# EAGLE design Slave_V0.1 (EAGLE 9.6.2)

## Sheet 1 of 2
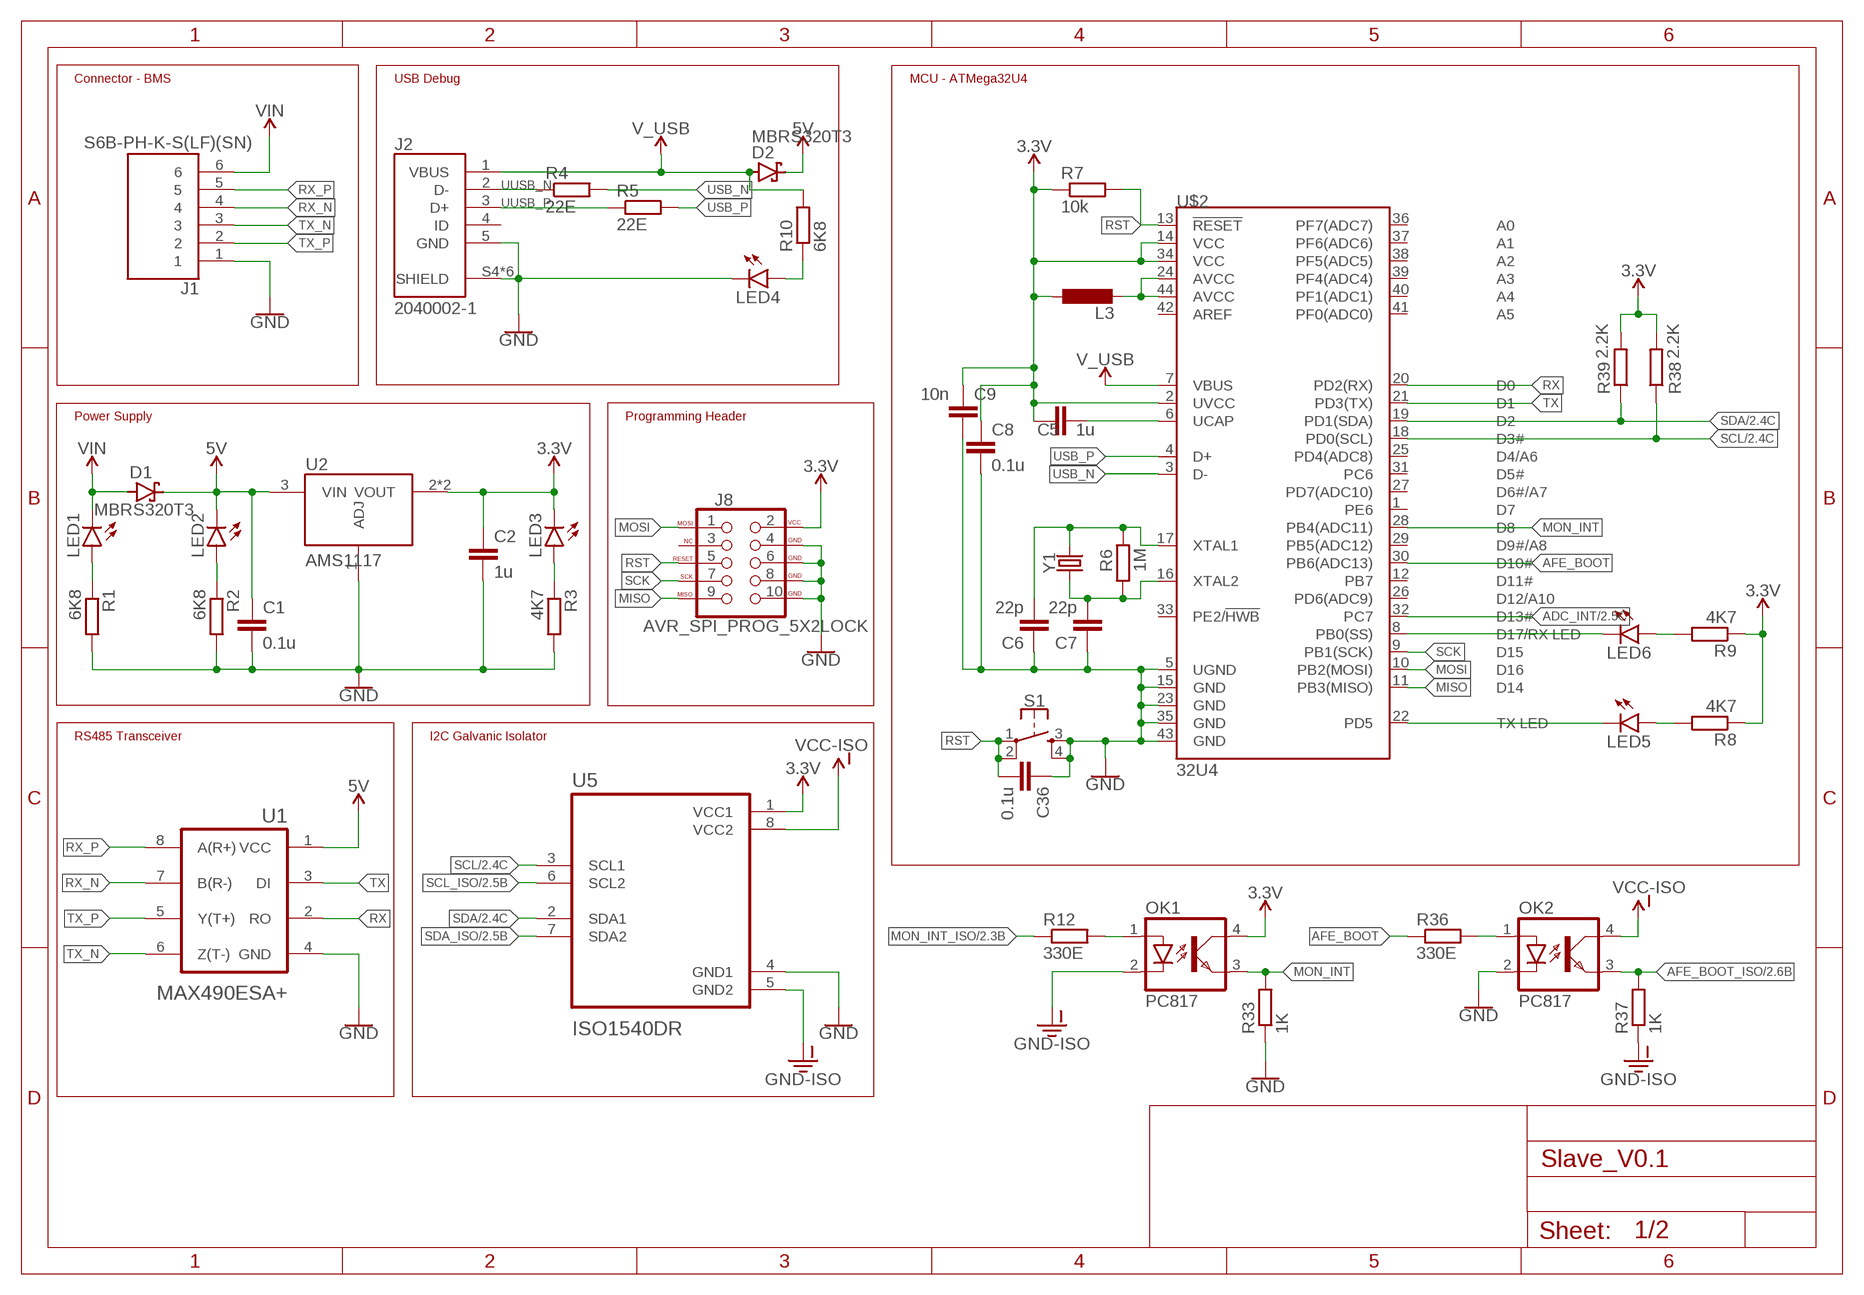
[diagram p0: schematic, sheet 1]

### Parts
C1  0.1u  C-EUC0805  [C0805]
C2  1u  C-EUC0805  [C0805]
C5  1u  C-EUC0805  [C0805]
C6  22p  C-EUC0805  [C0805]
C7  22p  C-EUC0805  [C0805]
C8  0.1u  C-EUC0805  [C0805]
C9  10n  C-EUC0805  [C0805]
C36  0.1u  C-EUC0805  [C0805]
D1  MBRS320T3  [SMC]
D2  MBRS320T3  [SMC]
J1  S6B-PH-K-S(LF)(SN)  [JST_S6B-PH-K-S(LF)(SN)]
J2  2040002-1  [TE_2040002-1]
J8  AVR_SPI_PROG_5X2LOCK  [2X5-SHROUDED_LOCK]
L3  L-EUL2012C  [L2012C]
LED1  LEDCHIPLED_0805  [CHIPLED_0805]
LED2  LEDCHIPLED_0805  [CHIPLED_0805]
LED3  LEDCHIPLED_0805  [CHIPLED_0805]
LED4  LEDCHIPLED_0805  [CHIPLED_0805]
LED5  LEDCHIPLED_0805  [CHIPLED_0805]
LED6  LEDCHIPLED_0805  [CHIPLED_0805]
OK1  PC817  [DIL04]
OK2  PC817  [DIL04]
R1  6K8  R-EU_R0805  [R0805]
R2  6K8  R-EU_R0805  [R0805]
R3  4K7  R-EU_R0805  [R0805]
R4  22E  R-EU_R0805  [R0805]
R5  22E  R-EU_R0805  [R0805]
R6  1M  R-EU_R0805  [R0805]
R7  10k  R-EU_R0805  [R0805]
R8  4K7  R-EU_R0805  [R0805]
R9  4K7  R-EU_R0805  [R0805]
R10  6K8  R-EU_R0805  [R0805]
R12  330E  R-EU_R0805  [R0805]
R33  1K  R-EU_R0805  [R0805]
R36  330E  R-EU_R0805  [R0805]
R37  1K  R-EU_R0805  [R0805]
R38  2.2K  R-EU_R0805  [R0805]
R39  2.2K  R-EU_R0805  [R0805]
S1  MOMENTARY-SWITCH-SPST-2-SMD-5.2MM  [TACTILE_SWITCH_SMD_5.2MM]
U1  MAX490ESA+  [SOIC127P600X175-8N]
U2  AMS1117  [SOT230P700X170-4]
U5  ISO1540DR  [SOIC127P599X175-8N]
U$2  32U4  ATMEGA32U4TQFP-44  [TQFP44]
Y1  CRYSTALPTH-HC49UV  [HC49U]

### Nets
3.3V: C2.1 C5.1 C8.1 C9.1 J8.2(VCC) L3.1 LED3.C OK1.4(COL) R7.1 R8.1 R9.1 R38.2 R39.2 U2.2(VOUT) U2.4(VOUT) U5.1(VCC1) U$2.2(UVCC) U$2.14(VCC) U$2.34(VCC) ; also sheet 2
5V: C1.1 D1.C D2.C LED2.C U1.1(VCC) U2.3(VIN)
ADC_INT: U$2.32(PC7) ; also sheet 2
AFE_BOOT: R36.1 U$2.30(PB6(ADC13))
AFE_BOOT_ISO: OK2.3(EMIT) R37.2 ; also sheet 2
GND: C1.2 C2.2 C6.1 C7.1 C8.2 C9.2 C36.1 J1.1 J2.5(GND) J2.S4(SHIELD) J2.S5(SHIELD) J2.SH1(SHIELD) J2.SH2(SHIELD) J2.SH3(SHIELD) J2.SH4(SHIELD) J8.4(GND) J8.6(GND) J8.8(GND) J8.10(GND) LED4.C OK2.2(C) R1.2 R2.2 R3.2 R33.1 S1.3 S1.4 U1.4(GND) U2.1(ADJ) U5.4(GND1) U$2.5(UGND) U$2.15(GND) U$2.23(GND) U$2.35(GND) U$2.43(GND) ; also sheet 2
GND-ISO: OK1.2(C) R37.1 U5.5(GND2) ; also sheet 2
MISO: J8.9(MISO) U$2.11(PB3(MISO))
MON_INT: OK1.3(EMIT) R33.2 U$2.28(PB4(ADC11))
MON_INT_ISO: R12.1 ; also sheet 2
MOSI: J8.1(MOSI) U$2.10(PB2(MOSI))
N$1: LED1.A R1.1
N$2: LED3.A R3.1
N$3: LED2.A R2.1
N$7: L3.2 U$2.24(AVCC) U$2.44(AVCC)
N$8: C5.2 U$2.6(UCAP)
N$9: C6.2 R6.2 U$2.17(XTAL1) Y1.2
N$10: LED5.C U$2.22(PD5)
N$11: C7.2 R6.1 U$2.16(XTAL2) Y1.1
N$12: LED5.A R8.2
N$13: LED6.C U$2.8(PB0(SS))
N$14: LED6.A R9.2
N$15: LED4.A R10.1
N$43: OK2.1(A) R36.2
N$45: OK1.1(A) R12.2
RST: C36.2 J8.5(RESET) R7.2 S1.1 S1.2 U$2.13(!RESET)
RX: U1.2(RO) U$2.20(PD2(RX))
RX_N: J1.4 U1.7(B(R-))
RX_P: J1.5 U1.8(A(R+))
SCK: J8.7(SCK) U$2.9(PB1(SCK))
SCL: R38.1 U5.3(SCL1) U$2.18(PD0(SCL)) ; also sheet 2
SCL_ISO: U5.6(SCL2) ; also sheet 2
SDA: R39.1 U5.2(SDA1) U$2.19(PD1(SDA)) ; also sheet 2
SDA_ISO: U5.7(SDA2) ; also sheet 2
TX: U1.3(DI) U$2.21(PD3(TX))
TX_N: J1.3 U1.6(Z(T-))
TX_P: J1.2 U1.5(Y(T+))
USB_N: R4.2 U$2.3(D-)
USB_P: R5.2 U$2.4(D+)
UUSB_N: J2.2(D-) R4.1
UUSB_P: J2.3(D+) R5.1
V_USB: D2.A J2.1(VBUS) R10.2 U$2.7(VBUS)
VCC-ISO: OK2.4(COL) U5.8(VCC2) ; also sheet 2
VIN: D1.A J1.6 LED1.C
Unconnected: J2.4(ID) J8.3(NC) U$2.1(PE6) U$2.12(PB7) U$2.25(PD4(ADC8)) U$2.26(PD6(ADC9)) U$2.27(PD7(ADC10)) U$2.29(PB5(ADC12)) U$2.31(PC6) U$2.33(PE2/!HWB) U$2.36(PF7(ADC7)) U$2.37(PF6(ADC6)) U$2.38(PF5(ADC5)) U$2.39(PF4(ADC4)) U$2.40(PF1(ADC1)) U$2.41(PF0(ADC0)) U$2.42(AREF)

### Notes on the sheet
- Connector - BMS | USB Debug | MCU - ATMega32U4
- Power Supply | Programming Header
- RS485 Transceiver | I2C Galvanic Isolator

## Sheet 2 of 2
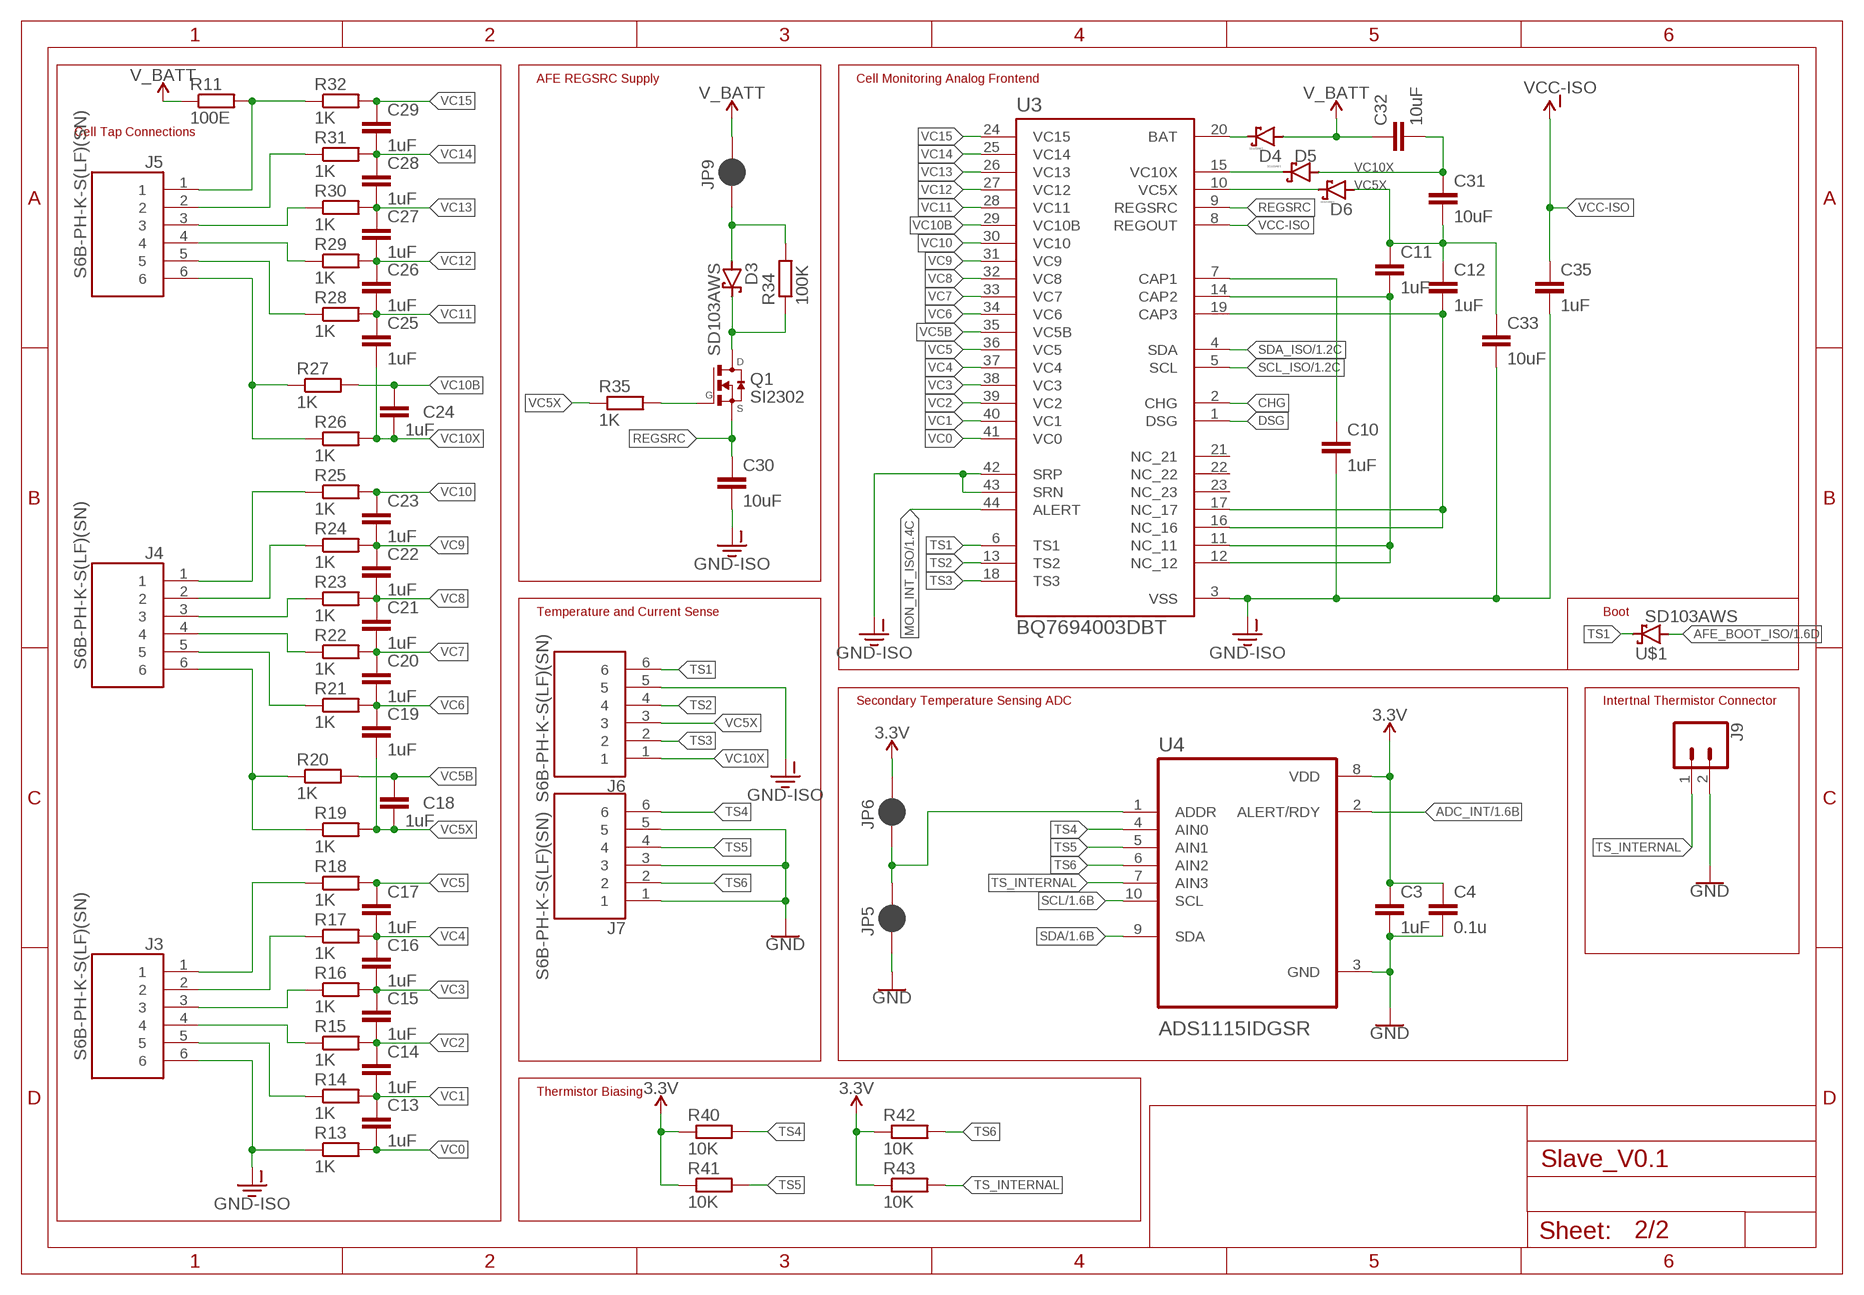
[diagram p1: schematic, sheet 2]

### Parts
C3  1uF  C-EUC0805K  [C0805K]
C4  0.1u  C-EUC0805K  [C0805K]
C10  1uF  C-EUC0805  [C0805]
C11  1uF  C-EUC0805  [C0805]
C12  1uF  C-EUC0805  [C0805]
C13  1uF  C-EUC0805  [C0805]
C14  1uF  C-EUC0805  [C0805]
C15  1uF  C-EUC0805  [C0805]
C16  1uF  C-EUC0805  [C0805]
C17  1uF  C-EUC0805  [C0805]
C18  1uF  C-EUC0805  [C0805]
C19  1uF  C-EUC0805  [C0805]
C20  1uF  C-EUC0805  [C0805]
C21  1uF  C-EUC0805  [C0805]
C22  1uF  C-EUC0805  [C0805]
C23  1uF  C-EUC0805  [C0805]
C24  1uF  C-EUC0805  [C0805]
C25  1uF  C-EUC0805  [C0805]
C26  1uF  C-EUC0805  [C0805]
C27  1uF  C-EUC0805  [C0805]
C28  1uF  C-EUC0805  [C0805]
C29  1uF  C-EUC0805  [C0805]
C30  10uF  C-EUC0805  [C0805]
C31  10uF  C-EUC0805  [C0805]
C32  10uF  C-EUC0805  [C0805]
C33  10uF  C-EUC0805  [C0805]
C35  1uF  C-EUC0805  [C0805]
D3  SD103AWS  [SOD323_ST]
D4  SD103AWS  [SOD323_ST]
D5  SD103AWS  [SOD323_ST]
D6  SD103AWS  [SOD323_ST]
J3  S6B-PH-K-S(LF)(SN)  [JST_S6B-PH-K-S(LF)(SN)]
J4  S6B-PH-K-S(LF)(SN)  [JST_S6B-PH-K-S(LF)(SN)]
J5  S6B-PH-K-S(LF)(SN)  [JST_S6B-PH-K-S(LF)(SN)]
J6  S6B-PH-K-S(LF)(SN)  [JST_S6B-PH-K-S(LF)(SN)]
J7  S6B-PH-K-S(LF)(SN)  [JST_S6B-PH-K-S(LF)(SN)]
J9  CONN_023.5MM-NO_SILK  [SCREWTERMINAL-3.5MM-2-NS]
JP5  JUMPER-SMT_2_NC_PASTE_SILK  [SMT-JUMPER_2_NC_PASTE_SILK]
JP6  JUMPER-SMT_2_NC_PASTE_SILK  [SMT-JUMPER_2_NC_PASTE_SILK]
JP9  JUMPER-SMT_2_NC_PASTE_SILK  [SMT-JUMPER_2_NC_PASTE_SILK]
Q1  SI2302  [SOT23]
R11  100E  R-EU_R0805  [R0805]
R13  1K  R-EU_R0805  [R0805]
R14  1K  R-EU_R0805  [R0805]
R15  1K  R-EU_R0805  [R0805]
R16  1K  R-EU_R0805  [R0805]
R17  1K  R-EU_R0805  [R0805]
R18  1K  R-EU_R0805  [R0805]
R19  1K  R-EU_R0805  [R0805]
R20  1K  R-EU_R0805  [R0805]
R21  1K  R-EU_R0805  [R0805]
R22  1K  R-EU_R0805  [R0805]
R23  1K  R-EU_R0805  [R0805]
R24  1K  R-EU_R0805  [R0805]
R25  1K  R-EU_R0805  [R0805]
R26  1K  R-EU_R0805  [R0805]
R27  1K  R-EU_R0805  [R0805]
R28  1K  R-EU_R0805  [R0805]
R29  1K  R-EU_R0805  [R0805]
R30  1K  R-EU_R0805  [R0805]
R31  1K  R-EU_R0805  [R0805]
R32  1K  R-EU_R0805  [R0805]
R34  100K  R-EU_R0805  [R0805]
R35  1K  R-EU_R0805  [R0805]
R40  10K  R-EU_R0805  [R0805]
R41  10K  R-EU_R0805  [R0805]
R42  10K  R-EU_R0805  [R0805]
R43  10K  R-EU_R0805  [R0805]
U3  BQ7694003DBT  [SOP50P640X120-44N]
U4  ADS1115IDGSR  [SOP50P490X110-10N]
U$1  SD103AWS  [SOD323_ST]

### Nets
3.3V: C3.1 C4.1 JP6.2 R40.1 R41.1 R42.1 R43.1 U4.8(VDD) ; also sheet 1
ADC_INT: U4.2(ALERT/RDY) ; also sheet 1
AFE_BOOT_ISO: U$1.A ; also sheet 1
CHG: U3.2(CHG)
DSG: U3.1(DSG)
GND: C3.2 C4.2 J7.1 J7.3 J7.5 J9.2 JP5.1 U4.3(GND) ; also sheet 1
GND-ISO: C10.2 C30.2 C33.2 C35.2 J3.6 J6.5 R13.1 U3.3(VSS) U3.42(SRP) U3.43(SRN) ; also sheet 1
MON_INT_ISO: U3.44(ALERT) ; also sheet 1
N$16: JP5.2 JP6.1 U4.1(ADDR)
N$17: C10.1 U3.7(CAP1)
N$18: C11.2 U3.11(NC_11) U3.12(NC_12) U3.14(CAP2)
N$19: D3.A JP9.1 R34.2
N$20: D3.C Q1.3(D) R34.1
N$21: C12.2 U3.16(NC_16) U3.17(NC_17) U3.19(CAP3)
N$22: J4.4 R22.1
N$23: J4.3 R23.1
N$24: J4.2 R24.1
N$25: J4.5 R21.1
N$26: J4.6 R19.1 R20.1
N$27: J4.1 R25.1
N$28: J3.4 R15.1
N$29: J3.3 R16.1
N$30: J3.2 R17.1
N$31: J3.5 R14.1
N$32: J5.4 R29.1
N$33: J3.1 R18.1
N$34: J5.3 R30.1
N$35: J5.2 R31.1
N$36: J5.5 R28.1
N$37: J5.6 R26.1 R27.1
N$38: Q1.1(G) R35.2
N$39: J5.1 R11.2 R32.1
N$40: D4.C U3.20(BAT)
N$41: D5.C U3.15(VC10X)
N$42: D6.C U3.10(VC5X)
REGSRC: C30.1 Q1.2(S) U3.9(REGSRC)
SCL: U4.10(SCL) ; also sheet 1
SCL_ISO: U3.5(SCL) ; also sheet 1
SDA: U4.9(SDA) ; also sheet 1
SDA_ISO: U3.4(SDA) ; also sheet 1
TS1: J6.6 U3.6(TS1) U$1.C
TS2: J6.4 U3.13(TS2)
TS3: J6.2 U3.18(TS3)
TS4: J7.6 R40.2 U4.4(AIN0)
TS5: J7.4 R41.2 U4.5(AIN1)
TS6: J7.2 R42.2 U4.6(AIN2)
TS_INTERNAL: J9.1 R43.2 U4.7(AIN3)
V_BATT: C32.1 D4.A JP9.2 R11.1
VC0: C13.2 R13.2 U3.41(VC0)
VC1: C13.1 C14.2 R14.2 U3.40(VC1)
VC2: C14.1 C15.2 R15.2 U3.39(VC2)
VC3: C15.1 C16.2 R16.2 U3.38(VC3)
VC4: C16.1 C17.2 R17.2 U3.37(VC4)
VC5: C17.1 R18.2 U3.36(VC5)
VC5B: C18.1 R20.2 U3.35(VC5B)
VC5X: C11.1 C12.1 C18.2 C19.2 C31.2 C33.1 D6.A J6.3 R19.2 R35.1
VC6: C19.1 C20.2 R21.2 U3.34(VC6)
VC7: C20.1 C21.2 R22.2 U3.33(VC7)
VC8: C21.1 C22.2 R23.2 U3.32(VC8)
VC9: C22.1 C23.2 R24.2 U3.31(VC9)
VC10: C23.1 R25.2 U3.30(VC10)
VC10B: C24.1 R27.2 U3.29(VC10B)
VC10X: C24.2 C25.2 C31.1 C32.2 D5.A J6.1 R26.2
VC11: C25.1 C26.2 R28.2 U3.28(VC11)
VC12: C26.1 C27.2 R29.2 U3.27(VC12)
VC13: C27.1 C28.2 R30.2 U3.26(VC13)
VC14: C28.1 C29.2 R31.2 U3.25(VC14)
VC15: C29.1 R32.2 U3.24(VC15)
VCC-ISO: C35.1 U3.8(REGOUT) ; also sheet 1
Unconnected: U3.21(NC_21) U3.22(NC_22) U3.23(NC_23)

### Notes on the sheet
- AFE REGSRC Supply | Cell Monitoring Analog Frontend
- Cell Tap Connections
- Temperature and Current Sense | Boot
- Secondary Temperature Sensing ADC | Intertnal Thermistor Connector
- Thermistor Biasing

## Library data of the parts
C1-C33 C35 C36 = rcl:C-EU: CAPACITOR, European symbol; SPICEPREFIX: C
D1 D2 = diode:MBRS3*0T3: SCHOTTKY BARRIER RECTIFIER 3.0 AMPERES 20, 30, 40 VOLT Source: MBRS340T3-D.pdf
D3-D6 U$1 = diode:SD103AWS
J1 = S6B-PH-K-S_LF__SN_:S6B-PH-K-S(LF)(SN): PH Series 6 Position 2 mm Pitch Through Hole Side Entry Shrouded Header; AVAILABILITY: Unavailable; DESCRIPTION: Connector Header Through Hole, Right Angle 6 position 0.079 (2.00mm); MF: JST Sales; MP: S6B-PH-K-S(LF)(SN); PACKAGE: None; PRICE: None; PURCHASELINK: https://www.sunrom.com/p/6-pin-jst-ph-20mm-through-hole-header-horizontal-right-angle-side-entry
J2 = 2040002-1:2040002-1: Conn USB Type B RCP 5 POS 0.65mm Solder RA SMD 5 Terminal 1 Port T/R; AVAILABILITY: Unavailable; CENTERLINE_PITCH: .65 mm[.025 in]; COMMENT: 2040002-1; DESCRIPTION: Conn Micro USB 2.0 Type B RCP 5 POS 0.65mm Solder RA SMD 5 Terminal 1 Port T/R; MF: TE Connectivity; MP: 2040002-1; NUMBER_OF_POSITIONS: 5; PACKAGE: None; PRICE: None; PRODUCT_TYPE: Connector; TE_PURCHASE_URL: https://www.te.com/usa-en/product-2040002-1.html?te_bu=Cor&te_type=disp&te_campaign=seda_glo_cor-seda-global-disp-prtnr-fy19-seda-model-bom-cta_sma-317_1&elqCampaignId=32493
J3-J7 = S6B-PH-K-S_LF__SN_:S6B-PH-K-S(LF)(SN): PH Series 6 Position 2 mm Pitch Through Hole Side Entry Shrouded Header; AVAILABILITY: Unavailable; DESCRIPTION: Connector Header Through Hole, Right Angle 6 position 0.079 (2.00mm); MF: JST Sales; MP: S6B-PH-K-S(LF)(SN); PACKAGE: None; PRICE: None
J8 = SparkFun-Connectors:AVR_SPI_PROG_5X2: AVR 10-pin ICSP Header This is the standard AVR In Circuit Serial Programming header. Minimal, but includes pin one indicator. Works with standard Olimex programmers. SparkFun Products: 2x5 AVR ICSP Male Header <https://www.sparkfun.com/products/778> - PTH 2x5 Pin Shrouded Header <https://www.sparkfun.com/products/8506> - PTH2; PROD_ID: CONN-08671; SF_ID: PRT-08506
J9 = SparkFun-Connectors:CONN_02: Multi connection point. Often used as Generic Header-pin footprint for 0.1 inch spaced/style header connections On any of the 0.1 inch spaced packages, you can populate with these: Break Away Headers - Straight <https://www.sparkfun.com/products/116> (PRT-00116) Break Away Male Headers - Right Angle <https://www.sparkfun.com/products/553> (PRT-00553) Female Headers <https://www.sparkfun.com/products/115> (PRT-00115) Break Away Headers - Machine Pin <https://www.sparkfun.com/products/117> (PRT-00117) Break Away Female Headers - Swiss Machine Pin <https://www.sparkfun.com/products/743> (PRT-00743) For SCREWTERMINALS and SPRING TERMINALS visit here: Screw Terimnals on SparkFun.com <https://www.sparkfun.com/search/results?term=Screw+Terminals> (5mm/3.5mm/2.54mm spacing) This device is also useful as a general connection point to wire up your design to another part of your project. Our various solder wires solder well into these plated through hole pads. Hook-Up Wire - Assortment (Stranded, 22 AWG) <https://www.sparkfun.com/products/11375> (PRT-11375) Hook-Up Wire - Assortment (Solid Core, 22 AWG) <https://www.sparkfun.com/products/11367> (PRT-11367) View the entire wire category on our website here <https://www.sparkfun.com/categories/141> Special notes: Molex polarized connector foot print use with: PRT-08233 with associated crimp pins and housings. 2.54_SCREWTERM for use with PRT-10571. 3.5mm Screw Terminal footprints for PRT-08084 5mm Screw Terminal footprints for use with PRT-08432; PROD_ID: CONN-08399
JP5 JP6 JP9 = SparkFun-Jumpers:JUMPER-SMT_2_NC_PASTE: Normally closed solder jumper This jumper has an aperture in the stencil to allow solder paste to bridge the split in the wire so it's normally closed (NC). Wick off the solder to open the connection. Reapply solder to reclose the connection.
L3 = rcl:L-EU: INDUCTOR, European symbol; SPICEPREFIX: L
LED1-LED6 = led:LED: LED OSRAM: - CHIPLED LG R971, LG N971, LY N971, LG Q971, LY Q971, LO R971, LY R971 LH N974, LH R974 LS Q976, LO Q976, LY Q976 LO Q996 - Hyper CHIPLED LW Q18S LB Q993, LB Q99A, LB R99A - SideLED LS A670, LO A670, LY A670, LG A670, LP A670 LB A673, LV A673, LT A673, LW A673 LH A674 LY A675 LS A676, LA A676, LO A676, LY A676, LW A676 LS A679, LY A679, LG A679 - Hyper Micro SIDELED® LS Y876, LA Y876, LO Y876, LY Y876 LT Y87S - SmartLED LW L88C, LW L88S LB L89C, LB L89S, LG L890 LS L89K, LO L89K, LY L89K LS L896, LA L896, LO L896, LY L896 - TOPLED LS T670, LO T670, LY T670, LG T670, LP T670 LSG T670, LSP T670, LSY T670, LOP T670, LYG T670 LG T671, LOG T671, LSG T671 LB T673, LV T673, LT T673, LW T673 LH T674 LS T676, LA T676, LO T676, LY T676, LB T676, LH T676, LSB T676, LW T676 LB T67C, LV T67C, LT T67C, LS T67K, LO T67K, LY T67K, LW E67C LS E67B, LA E67B, LO E67B, LY E67B, LB E67C, LV E67C, LT E67C LW T67C LS T679, LY T679, LG T679 LS T770, LO T770, LY T770, LG T770, LP T770 LB T773, LV T773, LT T773, LW T773 LH T774 LS E675, LA E675, LY E675, LS T675 LS T776, LA T776, LO T776, LY T776, LB T776 LHGB T686 LT T68C, LB T68C - Hyper Mini TOPLED® LB M676 - Mini TOPLED Santana® LG M470 LS M47K, LO M47K, LY M47K Source: http://www.osram.convergy.de LUXEON: - LUMILED® LXK2-PW12-R00, LXK2-PW12-S00, LXK2-PW14-U00, LXK2-PW14-V00 LXK2-PM12-R00, LXK2-PM12-S00, LXK2-PM14-U00 LXK2-PE12-Q00, LXK2-PE12-R00, LXK2-PE12-S00, LXK2-PE14-T00, LXK2-PE14-U00 LXK2-PB12-K00, LXK2-PB12-L00, LXK2-PB12-M00, LXK2-PB14-N00, LXK2-PB14-P00, LXK2-PB14-Q00 LXK2-PR12-L00, LXK2-PR12-M00, LXK2-PR14-Q00, LXK2-PR14-R00 LXK2-PD12-Q00, LXK2-PD12-R00, LXK2-PD12-S00 LXK2-PH12-R00, LXK2-PH12-S00 LXK2-PL12-P00, LXK2-PL12-Q00, LXK2-PL12-R00 Source: www.luxeon.com KINGBRIGHT: KA-3528ASYC Source: www.kingbright.com
OK1 OK2 = optocoupler:PC817: SHARP OPTO COUPLER; MPN: PC817X4J000F; OC_FARNELL: 9707727; OC_NEWARK: 97K7059
Q1 = SI2302:SI2302: MOSFET N-Channel 20 V (D-S); AVAILABILITY: Unavailable; DESCRIPTION: N-Channel 20V 2.6A _Ta_ 710mW _Ta_ Surface Mount SOT-23-3 _TO-236_; MF: Vishay Siliconix; MP: SI2302; PACKAGE: SOT-23-3 Vishay Siliconix; PRICE: None
R1-R43 = rcl:R-EU_: RESISTOR, European symbol; SPICEPREFIX: R
S1 = SparkFun-Switches:MOMENTARY-SWITCH-SPST-2: Momentary Switch (Pushbutton) - SPST - Two Circuits Normally-open (NO) SPST momentary switches (buttons, pushbuttons). Schematic symbol includes two switch circuits. Variants SMD-4.6MMX2.8MM - 4.60mm x 2.80mm Tactile Momentary Button Switch - Used on SparkFun SAMD21 Mini Breakout <https://www.sparkfun.com/products/13664> SMD-5.2MM - Mini Pushbutton Switch - SMD <https://www.sparkfun.com/products/8720> - Used on Arduino Pro Mini <https://www.sparkfun.com/products/11114>; PROD_ID: SWCH-08247; SF_SKU: COM-08720
U1 = MAX490ESA_:MAX490ESA+: None Check prices <https://snapeda.com/parts/MAX490ESA%2B/Maxim%20Integrated/view-part/?ref=eda>; AVAILABILITY: Warning; DESCRIPTION: 1/1 Transceiver Full RS422, RS485 8-SOIC; DIGIKEY-PURCHASE-URL: https://snapeda.com/shop?store=DigiKey&id=1237744; MF: Maxim Integrated; MOUSER-PURCHASE-URL: https://snapeda.com/shop?store=Mouser&id=1237744; MP: MAX490ESA+; PACKAGE: SOIC-8 Maxim; PRICE: None
U2 = AMS1117:AMS1117: Sot223/Pkg 1-Amp 5-Volt Low Drop Out Voltage Regulatator; DATASHEET-URL: http://www.advanced-monolithic.com/pdf/ds1117.pdf; DESCRIPTION: 3.3V 1A LDO; MF: Advanced Monolithic Systems, Inc.; MP: AMS1117; PACKAGE: SOT-223; PURCHASE-URL: https://www.evelta.com/ams1117-3-3-advanced-monolithic-systems-3-3v-1a-ldo-voltage-regulator/
U3 = BQ7694003DBT:BQ7694003DBT: 9 to 15-series cell li-ion and li-phosphate battery monitor (bq76940 family) 44-TSSOP -40 to 85 Check prices <https://snapeda.com/parts/BQ7694003DBT/Texas%20Instruments/view-part/?ref=eda>; AVAILABILITY: Good; DESCRIPTION: 9 to 15-series cell li-ion and li-phosphate battery monitor (bq76940 family) 44-TSSOP -40 to 85; DIGIKEY-PURCHASE-URL: https://snapeda.com/shop?store=DigiKey&id=425582; MF: Texas Instruments; MOUSER-PURCHASE-URL: https://snapeda.com/shop?store=Mouser&id=425582; MP: BQ7694003DBT; PACKAGE: TSSOP-44 Texas Instruments; PRICE: None; TEXAS_INSTRUMENTS-PURCHASE-URL: https://snapeda.com/shop?store=Texas+Instruments&id=425582
U4 = ADS1115IDGSR:ADS1115IDGSR: Check prices <https://snapeda.com/parts/ADS1115IDGSR/Texas%20Instruments/view-part/?ref=eda>; AVAILABILITY: Good; DESCRIPTION: 16-Bit 860SPS 4-Ch Delta-Sigma ADC With PGA, Oscillator, Vref, Comparator, and I2C 10-VSSOP -40 to 125; DIGIKEY-PURCHASE-URL: https://snapeda.com/shop?store=DigiKey&id=45903; MF: Texas Instruments; MOUSER-PURCHASE-URL: https://snapeda.com/shop?store=Mouser&id=45903; MP: ADS1115IDGSR; PACKAGE: VSSOP-10 Texas Instruments; PRICE: None; TEXAS_INSTRUMENTS-PURCHASE-URL: https://snapeda.com/shop?store=Texas+Instruments&id=45903
U5 = ISO1540DR:ISO1540DR: Check prices <https://pricing.snapeda.com/search/part/ISO1540DR/?ref=eda>; AVAILABILITY: Good; DESCRIPTION: 2.5-kVrms, isolated bidirectional clock, bidirectional I2C isolator 8-SOIC -40 to 125; MF: Texas Instruments; MP: ISO1540DR; PACKAGE: SOIC-8 Texas Instruments; PRICE: None; PURCHASE-URL: https://pricing.snapeda.com/search/part/ISO1540DR/?ref=eda
U$2 = SparkFun-IC-Microcontroller:ATMEGA32U4: Atmel MCU, 32KByte Atmel 44-pin 8-bit Microcontroller with 32KBytes of ISP Flash and USB Controller Datasheet <http://cdn.sparkfun.com/datasheets/Dev/Arduino/Boards/ATMega32U4.pdf> SparkFun Products LilyPad Arduino USB - ATmega32U4 Board <https://www.sparkfun.com/products/12049> (DEV-12049) Pro Micro - 5V/16MHz <https://www.sparkfun.com/products/12640> (DEV-12640) Pro Micro - 3.3V/8MHz <https://www.sparkfun.com/products/12587> (DEV-12587) Fio v3 - ATmega32U4 <https://www.sparkfun.com/products/11520> (DEV-11520) Qduino Mini <https://www.sparkfun.com/products/13614> (DEV-13614) Makey Makey - Standard Kit <https://www.sparkfun.com/products/11511> (WIG-11511) Makey Makey Deluxe Kit <https://www.sparkfun.com/products/11519> (WIG-11519); PROD_ID: IC-11161
Y1 = SparkFun-Clocks:CRYSTAL: Crystals (Generic) These are passive quartz crystals, which can be used as a clock source for a microcontroller. Crystal's are two-terminal devices. They require external "load" capacitors to generate an oscillating signal.

## Board
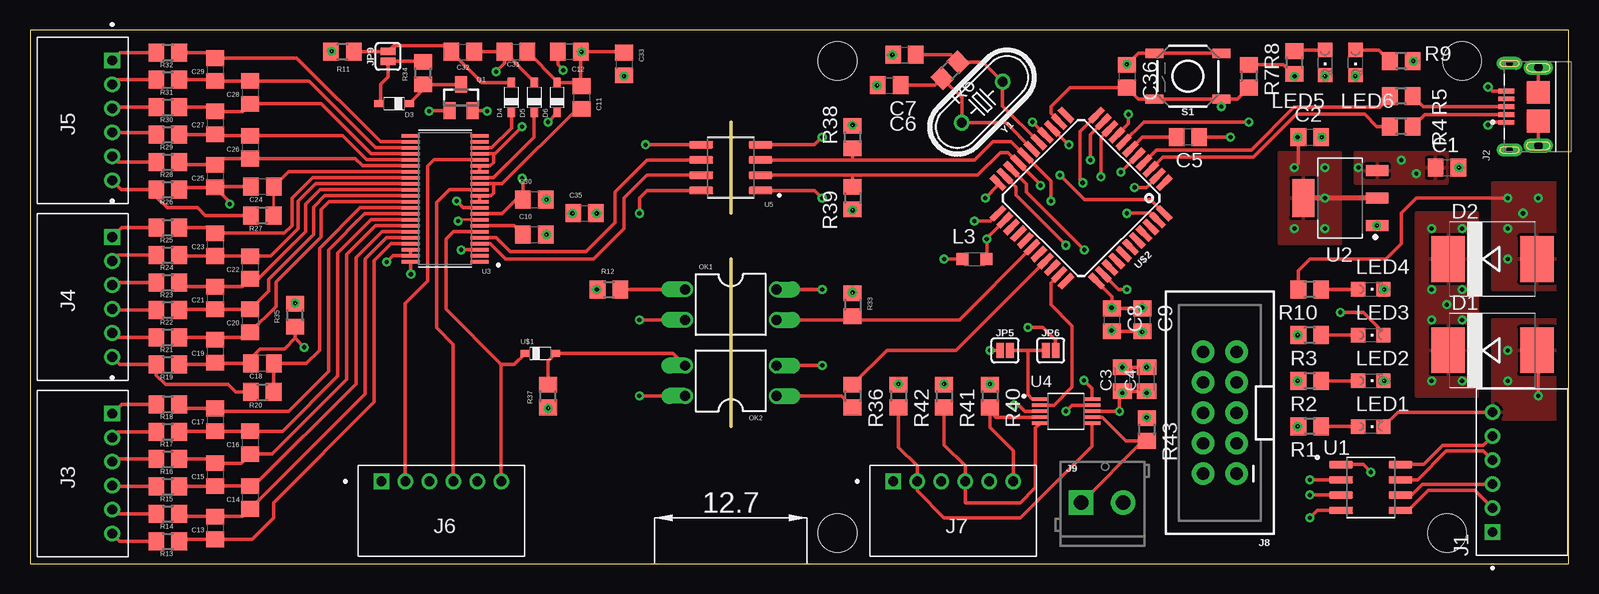
[diagram p2: board, top side]
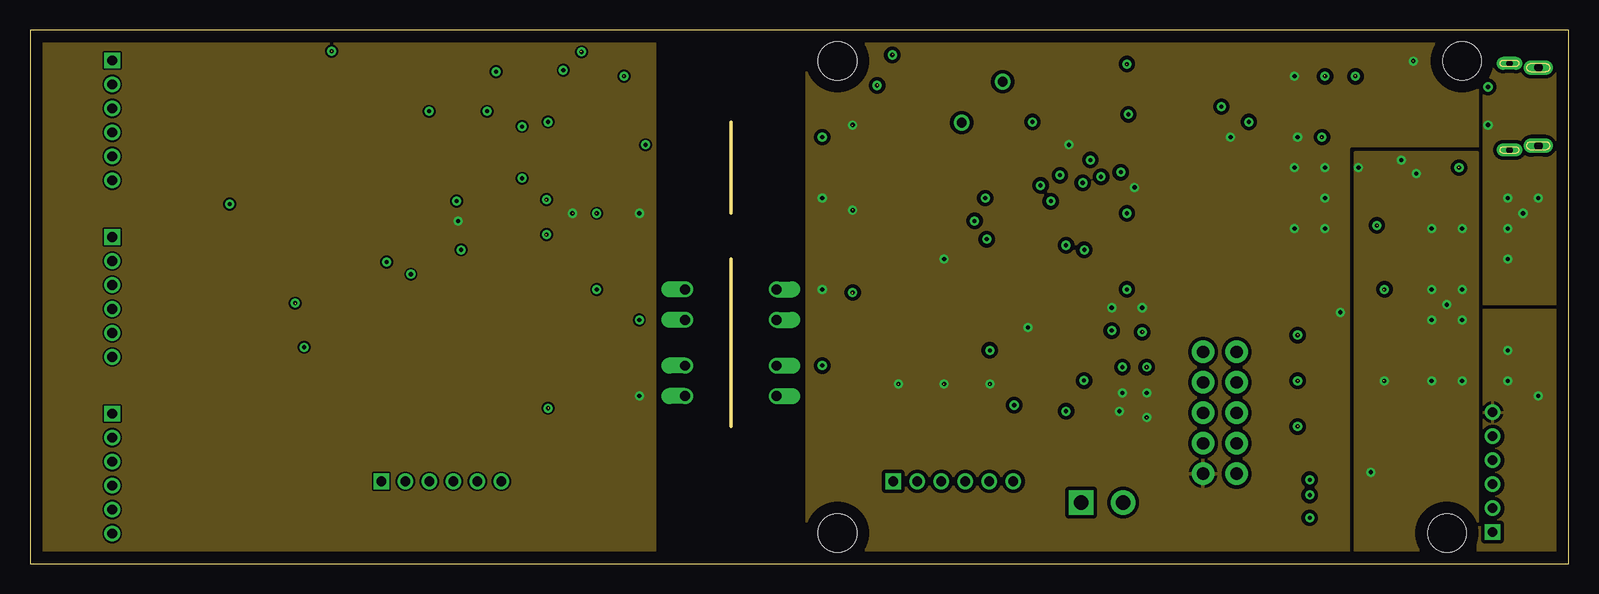
[diagram p3: board, inner layer PWR]
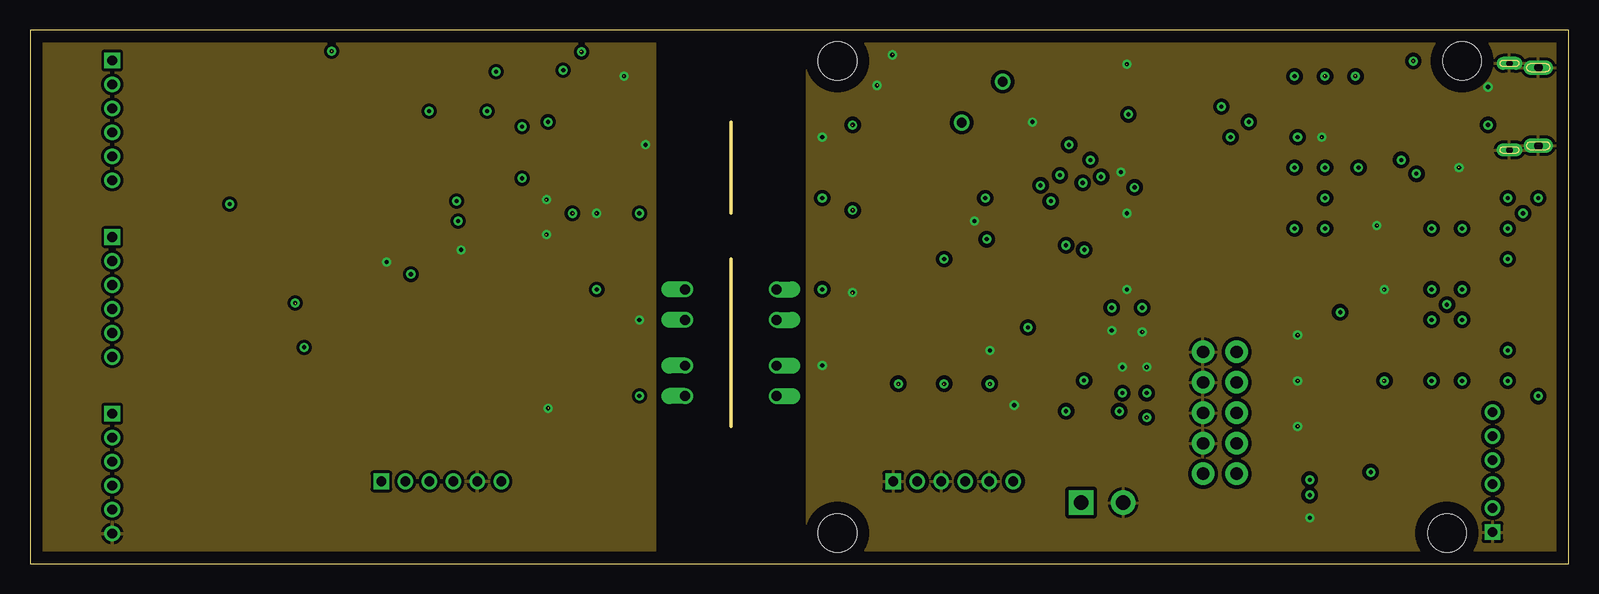
[diagram p4: board, inner layer GND]
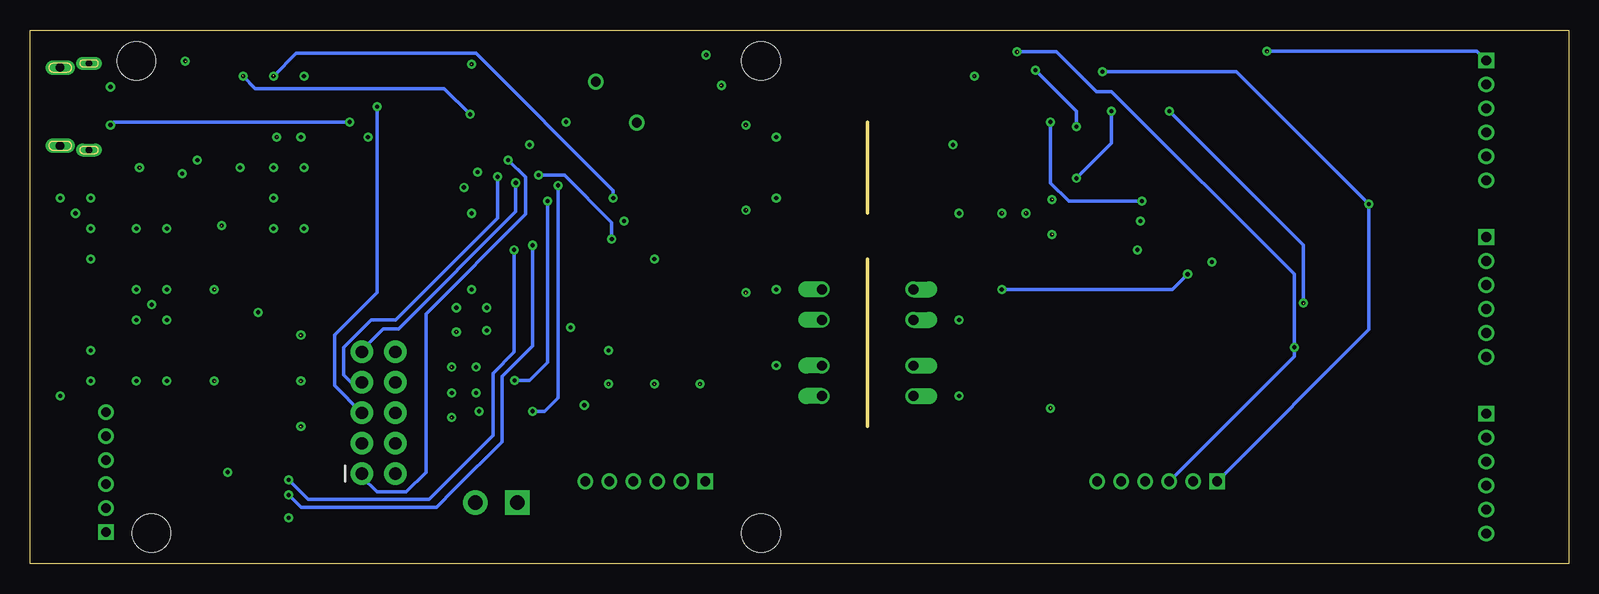
[diagram p5: board, bottom side, seen from below]

Size 128.25 x 44.5 mm. Coordinates in mm from the lower left corner, seen from the top.
Outline: 0,0 128.25,0 128.25,44.5 0,44.5 0,0
Copper layers (1+2*15+16): Top 0.035mm / dielectric 1.5mm / PWR 0.035mm / dielectric 0.15mm / GND 0.035mm / dielectric 0.2mm / Bottom 0.035mm
Design rules "default *": minimum track width 8mil, minimum drill 0.35mm, track to track 6mil, track to pad 6mil, pad to pad 6mil, via to via 6mil, smd to smd 6mil, copper to edge 40mil, drill to drill 6mil, minimum pad ring 10mil, minimum via ring 8mil, stop-mask expansion 4mil, vias tented up to drill 15mil, thermal gap 10mil
Holes 3.2 mm at 67.31,41.91 67.31,2.54 119.38,41.91 118.11,2.54
Milling: 2 lines

### Footprints (pad centres in the part's own frame; a part is rotated, then mirrored left to right if it is on the bottom)
C0805 = smd 1.3 x 1.5: 1 -0.95,0; 2 0.95,0
C0805K = smd 1.3 x 1.6: 1 -1,0; 2 1,0
SMC = smd 2.8 x 3.8: A 3.7,0; C -3.7,0
SOD323_ST = smd 0.8 x 0.6: A 1.25,0; C -1.25,0
JST_S6B-PH-K-S(LF)(SN) = drill 0.8 pad 1.2 square: 1 -5,0 | drill 0.8 pad 1.2: 2 -3,0; 3 -1,0; 4 1,0; 5 3,0; 6 5,0
TE_2040002-1 = smd 0.4 x 1.35: 1 -1.3,2.675; 2 -0.65,2.675; 3 0,2.675; 4 0.65,2.675; 5 1.3,2.675 | smd 1.9 x 1.9: S4 -1.2,0; S5 1.2,0 | drill 0.56 long: SH1 -3.615,2.4; SH2 3.615,2.4 | drill 0.71 long: SH3 3.255,0; SH4 -3.255,0
2X5-SHROUDED_LOCK = drill 1.016 pad 1.88: 1 -1.397,5.08; 2 1.397,5.08; 3 -1.397,2.54; 4 1.397,2.54; 5 -1.397,0; 6 1.397,0; 7 -1.397,-2.54; 8 1.397,-2.54; 9 -1.397,-5.08; 10 1.397,-5.08
SCREWTERMINAL-3.5MM-2-NS = drill 1.2 pad 2.032 square: 1 0,0 | drill 1.2 pad 2.032: 2 3.5,0
SMT-JUMPER_2_NC_PASTE_SILK = smd 0.635 x 1.27: 1 -0.406,0; 2 0.406,0
L2012C = smd 1 x 1: 1 -1,0; 2 1,0
CHIPLED_0805 = smd 1.2 x 1.2: A 0,-1.05; C 0,1.05
DIL04 = drill 0.813 offset: 1 -1.27,-3.81; 2 1.27,-3.81; 3 1.27,3.81; 4 -1.27,3.81
SOT23 = smd 1 x 1.4: 1 -0.95,-1.1; 2 0.95,-1.1; 3 0,1.1
R0805 = smd 1.3 x 1.5: 1 -0.95,0; 2 0.95,0
TACTILE_SWITCH_SMD_5.2MM = smd 1.524 x 0.762: 1 -2.794,1.905; 2 2.794,1.905; 3 -2.794,-1.905; 4 2.794,-1.905
SOIC127P600X175-8N = smd 1.97 x 0.59: 1 -2.475,1.905; 2 -2.475,0.635; 3 -2.475,-0.635; 4 -2.475,-1.905; 5 2.475,-1.905; 6 2.475,-0.635; 7 2.475,0.635; 8 2.475,1.905
SOT230P700X170-4 = smd 1.86 x 0.898: 1 -3.075,2.3; 2 -3.075,0; 3 -3.075,-2.3 | smd 1.86 x 3.189: 4 3.075,0
SOP50P640X120-44N = smd 1.57 x 0.28: 1 -2.87,5.25; 2 -2.87,4.75; 3 -2.87,4.25; 4 -2.87,3.75; 5 -2.87,3.25; 6 -2.87,2.75; 7 -2.87,2.25; 8 -2.87,1.75; 9 -2.87,1.25; 10 -2.87,0.75; 11 -2.87,0.25; 12 -2.87,-0.25; 13 -2.87,-0.75; 14 -2.87,-1.25; 15 -2.87,-1.75; 16 -2.87,-2.25; 17 -2.87,-2.75; 18 -2.87,-3.25; 19 -2.87,-3.75; 20 -2.87,-4.25; 21 -2.87,-4.75; 22 -2.87,-5.25; 23 2.87,-5.25; 24 2.87,-4.75; 25 2.87,-4.25; 26 2.87,-3.75; 27 2.87,-3.25; 28 2.87,-2.75; 29 2.87,-2.25; 30 2.87,-1.75; 31 2.87,-1.25; 32 2.87,-0.75; 33 2.87,-0.25; 34 2.87,0.25; 35 2.87,0.75; 36 2.87,1.25; 37 2.87,1.75; 38 2.87,2.25; 39 2.87,2.75; 40 2.87,3.25; 41 2.87,3.75; 42 2.87,4.25; 43 2.87,4.75; 44 2.87,5.25
SOP50P490X110-10N = smd 1.47 x 0.28: 1 -2.15,1; 2 -2.15,0.5; 3 -2.15,0; 4 -2.15,-0.5; 5 -2.15,-1; 6 2.15,-1; 7 2.15,-0.5; 8 2.15,0; 9 2.15,0.5; 10 2.15,1
SOIC127P599X175-8N = smd 1.97 x 0.6: 1 -2.47,1.905; 2 -2.47,0.635; 3 -2.47,-0.635; 4 -2.47,-1.905; 5 2.47,-1.905; 6 2.47,-0.635; 7 2.47,0.635; 8 2.47,1.905
TQFP44 = smd 1.5 x 0.5: 1 -5.8,4; 2 -5.8,3.2; 3 -5.8,2.4; 4 -5.8,1.6; 5 -5.8,0.8; 6 -5.8,0; 7 -5.8,-0.8; 8 -5.8,-1.6; 9 -5.8,-2.4; 10 -5.8,-3.2; 11 -5.8,-4; 23 5.8,-4; 24 5.8,-3.2; 25 5.8,-2.4; 26 5.8,-1.6; 27 5.8,-0.8; 28 5.8,0; 29 5.8,0.8; 30 5.8,1.6; 31 5.8,2.4; 32 5.8,3.2; 33 5.8,4 | smd 0.5 x 1.5: 12 -4,-5.8; 13 -3.2,-5.8; 14 -2.4,-5.8; 15 -1.6,-5.8; 16 -0.8,-5.8; 17 0,-5.8; 18 0.8,-5.8; 19 1.6,-5.8; 20 2.4,-5.8; 21 3.2,-5.8; 22 4,-5.8; 34 4,5.8; 35 3.2,5.8; 36 2.4,5.8; 37 1.6,5.8; 38 0.8,5.8; 39 0,5.8; 40 -0.8,5.8; 41 -1.6,5.8; 42 -2.4,5.8; 43 -3.2,5.8; 44 -4,5.8
HC49U = drill 0.813: 1 -2.413,0; 2 2.413,0

### Placement (x,y rotation side)
C1  118.11,33.02 0 top
C2  106.68,35.56 0 top
C3  91.06,15.37 90 top
C4  93.09,15.37 90 top
C5  96.52,35.56 180 top
C6  71.63,39.88 0 top
C7  72.9,42.42 0 top
C8  90.17,20.32 270 top
C9  92.71,20.32 270 top
C10  42.04,27.43 0 top
C11  45.97,38.86 270 top
C12  44.96,42.67 180 top
C13  15.44,2.97 270 top
C14  18.36,5.51 270 top
C15  15.44,7.42 270 top
C16  18.36,10.08 270 top
C17  15.44,11.99 270 top
C18  19.37,16.69 180 top
C19  15.44,17.7 270 top
C20  18.36,20.24 270 top
C21  15.44,22.15 270 top
C22  18.36,24.69 270 top
C23  15.44,26.59 270 top
C24  19.37,31.42 180 top
C25  15.44,32.31 270 top
C26  18.36,34.72 270 top
C27  15.44,36.75 270 top
C28  18.36,39.29 270 top
C29  15.44,41.2 270 top
C30  42.04,30.35 0 top
C31  40.51,42.67 0 top
C32  36.07,42.67 0 top
C33  49.53,41.66 270 top
C35  46.23,29.21 0 top
C36  91.44,40.64 270 top
D1  121.92,17.78 0 top
D2  121.92,25.4 0 top
D3  30.35,38.35 180 top
D4  40.13,38.86 90 top
D5  42.04,38.86 90 top
D6  43.94,38.86 90 top
J1  121.92,7.62 90 top
J2  125.73,38.1 90 top
J3  6.86,7.49 270 top
J4  6.86,22.23 270 top
J5  6.86,36.96 270 top
J6  34.29,6.86 0 top
J7  76.96,6.86 0 top
J8  99.19,12.57 180 top
J9  87.63,5.08 0 top
JP5  81.28,17.78 0 top
JP6  85.09,17.78 0 top
JP9  29.84,42.29 90 top
L3  78.74,25.4 0 top
LED1  111.76,11.43 270 top
LED2  111.76,15.24 270 top
LED3  111.76,19.05 270 top
LED4  111.76,22.86 270 top
LED5  107.95,41.78 180 top
LED6  110.49,41.78 180 top
OK1  58.42,21.59 270 top
OK2  58.42,15.24 90 top
Q1  35.94,38.86 0 top
R1  106.68,11.43 180 top
R2  106.68,15.24 180 top
R3  106.68,19.05 180 top
R4  114.3,36.45 180 top
R5  114.3,38.99 180 top
R6  76.71,41.15 225 top
R7  101.6,40.64 270 top
R8  105.41,41.78 90 top
R9  114.3,41.91 180 top
R10  106.68,22.86 180 top
R11  26.04,42.67 180 top
R12  48.26,22.86 0 top
R13  11.49,1.85 0 top
R14  11.49,4.14 0 top
R15  11.49,6.43 0 top
R16  11.49,8.71 0 top
R17  11.49,11 0 top
R18  11.49,13.28 0 top
R19  11.49,16.59 0 top
R20  19.36,14.3 0 top
R21  11.49,18.87 0 top
R22  11.49,21.16 0 top
R23  11.49,23.44 0 top
R24  11.49,25.73 0 top
R25  11.49,28.02 0 top
R26  11.49,31.19 0 top
R27  19.36,29.03 0 top
R28  11.49,33.48 0 top
R29  11.49,35.76 0 top
R30  11.49,38.05 0 top
R31  11.49,40.34 0 top
R32  11.49,42.62 0 top
R33  68.58,21.59 270 top
R34  32.77,40.89 90 top
R35  22.1,20.7 90 top
R36  68.58,13.97 270 top
R37  43.18,13.97 90 top
R38  68.58,35.56 90 top
R39  68.58,30.48 270 top
R40  80.01,13.97 270 top
R41  76.2,13.97 270 top
R42  72.39,13.97 270 top
R43  93.09,11.18 270 top
S1  96.52,40.64 180 top
U1  111.76,6.35 0 top
U2  109.22,30.48 180 top
U3  34.6,30.43 180 top
U4  86.36,12.7 0 top
U5  58.42,33.02 180 top
U$1  42.55,17.53 0 top
U$2  87.63,30.48 225 top
Y1  79.38,38.48 225 top

### Tracks (layer width: path | path; a pad name or v marks a point on that pad's centre or on a via)
3.3V  (via drill 0.35)  (7 unrouted)
  Top 0.305: LED3.C 112.81,19.27 111.12,20.95 v109.22,20.95 | OK1.4 v66.04,22.86 | U$2.34 90.17,22.28 v90.17,21.34 C8.1 C9.1 | R8.1 v105.41,40.64 104.46,41.59 R7.1 | U$2.14 86.58,34.92 v86.61,34.92 | U$2.2 93.04,31.37 v92.08,31.37 | C5.1 v100.08,35.56 | JP6.2 85.5,18.64 84.45,19.68 v83.19,19.68 | U4.8 v90.81,12.7 90.81,13.97 v91.06,14.22 C3.1 C4.1 | U5.1 65.41,31.11 v66.04,30.48 | C2.1 105.73,33.34 v105.41,33.02 | v76.2,25.4 L3.1
  Top 0.406: U2.2 U2.4
  other vias: 107.95,33.02 107.95,30.48 107.95,27.94 105.41,27.94 115.32,41.91 68.58,36.58 68.58,29.46 76.2,14.99 92.71,21.34 93.09,14.22 80.01,14.99 105.66,35.56 72.39,14.99 93.09,12.19
  pour PWR (isolate 0.305, rank 3): 64.77,44.45 120.65,44.45 120.65,0 64.77,0
  pour Top: 104.14,34.29 109.22,34.29 109.22,26.67 104.14,26.67
5V  (via drill 0.35)  (1 unrouted)
  Top 0.305: U1.1 111.12,8.26 v111.76,7.62
  other vias: 112.9,15.24 119.38,22.86 116.84,22.86 116.84,20.32 119.38,20.32 118.11,21.59 116.84,15.24 119.38,15.24 116.84,27.94 119.38,27.94 114.3,33.66 115.57,32.51 110.74,33.02
  pour PWR (isolate 0.305): 120.65,0 110.49,0 110.49,34.29 120.65,34.29
  pour Top: 120.65,29.21 115.57,29.21 115.57,15.24 115.57,13.97 120.65,13.97
  pour Top: 110.49,34.29 110.49,31.75 118.11,31.75 118.11,34.29
ADC_INT
  Top 0.305: U4.2 85.34,13.2 86.87,14.73 86.87,19.81 85.09,21.59 85.09,23.41 U$2.32
AFE_BOOT
  Top 0.305: U$2.30 77.19,17.78 71.44,17.78 R36.1
AFE_BOOT_ISO
  Top 0.305: R37.2 43.18,16.91 U$1.A 53.59,17.53 OK2.3
GND  (via drill 0.35)  (13 unrouted)
  Top 0.305: J2.5 121.89,39.4 v121.54,39.75 | J2.S5 J2.SH3 | J2.S4 J2.SH4 | C1.2 119.38,32.7 | OK2.2 v66.04,16.51 | C7.1 71.44,41.91 | U1.4 107.31,4.45 v106.68,3.81 | C36.1 92.39,42.55 S1.4 S1.3 | U$2.35 90.72,22.86 v91.44,22.86 | U$2.43 93.42,29.21 v91.44,29.21 | U$2.23 80.07,28.57 v78.74,28.57 | U$2.15 83.57,36.81 v83.57,36.83 | U$2.5 90.93,32.65 v90.93,32.64 | JP5.1 v80.01,17.78 | U5.4 65.41,34.92 v66.04,35.56 | U4.3 82.94,12.7 82.43,13.21 v82.04,13.21 | C4.2 C3.2 | C8.2 C9.2
  other vias: 112.9,22.86 119.13,33.02 71.88,42.42 105.66,15.24 105.66,11.43 91.44,41.66 68.58,22.61 107.7,35.56 105.66,19.05 112.27,28.19 90.17,19.43 92.71,19.3 91.06,16.38 93.09,16.38 70.61,39.88
  pour GND (isolate 0.305): 64.77,44.45 128.27,44.45 128.27,0 64.77,0
GND-ISO  (via drill 0.35)  (5 unrouted)
  Top 0.203: C30.2 43.24,30.61 | 35.96,26.18 v35.94,26.16
  Top 0.305: J3.6 7.5,1.85 R13.1 | U3.42 U3.43 30.26,25.68 v29.72,25.14 | U5.5 v51.31,34.92 | U3.3 35.96,26.18 | OK1.2 v50.8,20.32 | C30.2 43.49,30.86 | v43.05,27.44 v43.04,27.43 | 47.18,29.41 C35.2
  other vias: 49.53,40.64 47.24,29.21 43.18,12.95 43.05,30.36
  pour GND (isolate 0.254): 52.07,0 0,0 0,44.45 52.07,44.45
MISO  (via drill 0.35)
  Top 0.305: U$2.11 87.5,36.01 87.5,32 v87.76,31.75
  Bottom 0.305: v87.76,31.75 87.76,29.34 97.54,19.56 98.81,19.56 100.58,17.78 J8.9
MON_INT
  Top 0.305: OK1.3 68.26,20.32 R33.2 68.9,20.32 77.47,20.32 U$2.28
MON_INT_ISO  (via drill 0.35)
  Top 0.203: v31.75,24.13 31.73,24.15
  Top 0.305: R12.1 v47.24,22.86 | 31.73,24.15 U3.44
  Bottom 0.305: v47.24,22.86 33.02,22.86 v31.75,24.13
MOSI  (via drill 0.35)
  Top 0.305: U$2.10 88.39,35.77 v88.39,33.66
  Bottom 0.305: v88.39,33.66 86.95,32.21 86.95,29.13 95.25,20.83 95.25,7.62 96.9,5.97 99.31,5.97 100.58,7.24 J8.1
N$1
  Top 0.305: R1.1 LED1.A
N$2
  Top 0.305: R3.1 LED3.A
N$3
  Top 0.305: R2.1 LED2.A
N$7  (via drill 0.35)
  Top 0.305: U$2.44 93.41,30.35 87.88,30.35 v85.85,32.38 | v79.76,27.05 79.76,26.67 | 79.76,26.67 79.76,25.42 L3.2 | U$2.24 79.76,27.13 79.76,26.67
  Bottom 0.305: v85.85,32.38 83.69,32.38 79.76,28.45 v79.76,27.05
N$8
  Top 0.305: U$2.6 92.71,35.56 C5.2
N$9
  Top 0.305: C6.2 75.44,39.88 R6.2 77.67,38.84 Y1.2 81.33,36.77 U$2.17
N$10  (via drill 0.35)  (1 unrouted)
  Top 0.305: v79.63,30.48 80.7,31.55 U$2.22
  Bottom 0.305: v107.95,40.64 106.05,42.55 91.06,42.55 79.63,31.11 v79.63,30.48
N$11
  Top 0.305: C7.2 76.78,42.42 R6.1 79.45,41.82 Y1.1 81.08,38.16 U$2.16
N$12
  Top 0.305: LED5.A 105.51,42.83 R8.2
N$13  (via drill 0.35)  (1 unrouted)
  Top 0.305: U$2.8 91.57,36.68 v91.57,37.47
  Bottom 0.305: v91.57,37.47 93.73,39.62 109.47,39.62 v110.49,40.64
N$14
  Top 0.305: LED6.A 112.43,42.83 R9.2
N$15
  Top 0.305: R10.1 LED4.A
N$16
  Top 0.305: JP5.2 82.93,17.78 83.19,17.78 | 83.19,17.78 JP6.1 | U4.1 83.58,13.7 83.19,14.09 83.19,17.78
N$17
  Top 0.305: U3.7 40.34,28.18 C10.1
N$18
  Top 0.203: 38.64,31.58 38.73,31.68
  Top 0.305: C11.2 45.59,37.91 39.36,31.68 38.73,31.68 U3.14 | U3.11 U3.12 38.43,30.68 38.64,30.89 38.64,31.58
N$19
  Top 0.203: 32.73,41.88 R34.2 | D3.A 29.21,38.46
  Top 0.305: 32.73,41.88 JP9.1 29.84,40.62 29.21,39.98 29.21,38.46
N$20
  Top 0.203: Q1.3 35.9,40.01 35.84,39.94 | 32.77,39.52 R34.1
  Top 0.305: D3.C 32.77,39.52 | R34.1 35.84,39.94
N$21  (via drill 0.35)
  Top 0.203: 38.64,34.07 38.75,34.18
  Top 0.305: U3.16 U3.17 38.36,33.18 38.64,33.45 38.64,34.07 | C12.2 44.01,41.59 v44.45,41.15 | v41.02,36.45 38.75,34.18 U3.19
  Bottom 0.305: v44.45,41.15 41.02,37.72 v41.02,36.45
N$22
  Top 0.305: J4.4 6.92,21.16 R22.1
N$23
  Top 0.305: J4.3 7.08,23.44 R23.1
N$24
  Top 0.305: J4.2 7.36,25.73 R24.1
N$25
  Top 0.305: J4.5 7.21,18.87 R21.1
N$26
  Top 0.305: J4.6 7.5,16.59 R19.1 10.54,15.7 11.3,14.94 16.51,14.94 17.14,14.3 R20.1
N$27
  Top 0.305: J4.1 7.65,28.02 R25.1
N$28
  Top 0.305: J3.4 6.92,6.43 R15.1
N$29
  Top 0.305: J3.3 7.08,8.71 R16.1
N$30
  Top 0.305: J3.2 7.36,11 R17.1
N$31
  Top 0.305: J3.5 7.21,4.14 R14.1
N$32
  Top 0.203: 10.35,35.96 R29.1
  Top 0.305: J5.4 10.35,35.96
N$33
  Top 0.305: J3.1 7.65,13.28 R18.1
N$34
  Top 0.203: J5.3 6.95,38.05
  Top 0.305: 6.95,38.05 R30.1
N$35
  Top 0.203: J5.2 7.24,40.34
  Top 0.305: 7.24,40.34 R31.1
N$36
  Top 0.203: J5.5 7.34,33.48
  Top 0.305: 7.34,33.48 R28.1
N$37
  Top 0.203: R26.1 10.54,30.56
  Top 0.305: J5.6 7.62,31.19 R26.1 | 10.54,30.56 11.43,29.67 13.97,29.67 14.6,29.03 R27.1
N$38  (via drill 0.35)  (1 unrouted)
  Top 0.203: 33.32,37.76 v33.27,37.72
  Top 0.305: Q1.1 33.32,37.76
  Bottom 0.305: v33.27,37.72 22.1,26.54 v22.1,21.72
N$39  (via drill 0.35)  (1 unrouted)
  Top 0.305: J5.1 7.52,42.62 R32.1
  Bottom 0.305: J5.1 7.63,42.73 v25.15,42.73
N$40
  Top 0.305: D4.C 40.13,36.32 38.49,34.68 U3.20
N$41
  Top 0.305: D5.C 42.04,35.56 38.66,32.18 U3.15
N$42  (via drill 0.35)
  Top 0.203: D6.C 43.94,37.59
  Top 0.305: 43.94,37.59 v43.18,36.83 | v35.56,30.23 36.11,29.68 U3.10
  Bottom 0.305: v43.18,36.83 43.18,31.75 41.66,30.23 v35.56,30.23
N$43
  Top 0.305: OK2.1 67.63,13.97 R36.2
N$45
  Top 0.305: OK1.1 R12.2
REGSRC  (via drill 0.35)
  Top 0.203: C30.1 40.51,30.35
  Top 0.305: U3.9 39.34,29.18 40.51,30.35 | Q1.2 38.06,37.76 v38.1,37.72 | v41.02,32.13 41.09,32.06 C30.1
  Bottom 0.305: v38.1,37.72 38.1,35.05 v41.02,32.13
RST  (via drill 0.35)
  Top 0.305: v99.31,38.1 98.68,38.73 S1.2 92.39,38.73 C36.2 86.68,39.69 85.09,38.1 85.09,37.55 U$2.13 | v99.31,38.1 99.95,38.73 100.64,38.73 R7.2 | v99.31,38.1 S1.1
  Bottom 0.305: J8.5 102.87,14.86 102.87,19.05 99.31,22.61 v99.31,38.1
RX  (via drill 0.35)
  Top 0.305: U1.2 v106.68,6.99 | v87.88,26.16 83.06,30.99 83.06,31.66 U$2.20
  Bottom 0.305: v87.88,26.16 87.88,17.65 89.66,15.88 89.66,10.67 94.97,5.36 105.05,5.36 v106.68,6.99
RX_N
  Top 0.305: J1.4 121.15,9.39 118.08,9.39 115.67,6.99 U1.7
RX_P
  Top 0.305: J1.5 121.15,9.85 117.76,9.85 116.18,8.27 116.19,8.26 U1.8
SCK  (via drill 0.35)
  Top 0.305: U$2.9 89.28,35.52 v89.28,32.26
  Bottom 0.305: v89.28,32.26 89.28,28.83 97.79,20.32 99.82,20.32 102.11,18.03 102.11,15.75 101.47,15.11 J8.7
SCL  (via drill 0.35)
  Top 0.305: U5.3 67.31,33.66 67.62,33.66 68.58,33.66 | 68.58,33.66 78.74,33.66 80.26,35.18 81.79,35.18 U$2.18 85.1,31.88 v85.1,30.22 | R38.1 68.58,33.66 | U4.10 88.51,14.61 v87.86,15.27
  Bottom 0.305: v85.1,30.22 85.1,16.76 86.59,15.27 v87.86,15.27
SCL_ISO
  Top 0.305: U3.5 38.86,27.18 40.01,26.04 46.35,26.04 48.77,28.45 48.77,30.99 51.44,33.66 U5.6
SDA  (via drill 0.35)
  Top 0.305: U5.2 67.62,32.38 68.58,32.38 | 68.58,32.38 78.99,32.38 80.9,34.29 81.53,34.29 82.37,33.45 U$2.19 84.24,31.61 v84.24,31.53 | R39.1 68.58,32.38 | U4.9 86.86,13.2 v86.36,12.7
  Bottom 0.305: v84.24,31.53 84.24,13.8 85.34,12.7 v86.36,12.7
SDA_ISO
  Top 0.305: U3.4 38.36,26.68 39.64,25.4 46.99,25.4 49.53,27.94 49.53,30.48 51.44,32.38 U5.7
TS1
  Top 0.305: U3.6 35.3,27.68 34.67,27.05 34.67,21.21 39.29,16.59 | 39.29,16.59 J6.6 | 39.29,16.59 40.36,16.59 U$1.C
TS2
  Top 0.305: U3.13 34.99,31.18 33.91,30.1 33.91,19.67 35.29,18.29 J6.4
TS3
  Top 0.305: U3.18 33.68,33.68 33.15,33.15 33.15,23.57 31.29,21.7 J6.2
TS4
  Top 0.305: 80.01,12.7 80.01,11.35 81.96,9.4 J7.6 | 80.01,12.7 R40.2 | U4.4 80.51,12.2 80.01,12.7
TS5
  Top 0.305: R41.2 76.2,9.89 77.96,8.13 J7.4 77.96,5.08 82.55,5.08 83.82,6.35 83.82,11.31 U4.5
TS6
  Top 0.305: R42.2 72.39,9.7 73.96,8.13 J7.2 73.96,6.05 76.2,3.81 82.55,3.81 88.51,9.77 U4.6
TS_INTERNAL
  Top 0.305: J9.1 92.78,10.23 R43.2 91.37,10.23 89.4,12.2 U4.7
TX  (via drill 0.35)
  Top 0.305: U$2.21 82.17,31.42 82.17,30.73 v86.36,26.54 | v106.68,5.71 U1.3
  Bottom 0.305: v86.36,26.54 86.36,18.16 88.9,15.62 88.9,10.16 92.84,6.22 94.36,4.7 105.66,4.7 v106.68,5.71
TX_N
  Top 0.305: J1.3 116.08,6.62 115.18,5.71 U1.6
TX_P
  Top 0.305: J1.2 120.43,6.11 116.54,6.11 114.88,4.45 U1.5
USB_N
  Top 0.305: U$2.3 94.45,33.91 101.99,33.91 105.55,37.47 111.25,37.47 112.27,36.45 R4.2
USB_P
  Top 0.305: U$2.4 93.91,34.49 101.8,34.49 105.36,38.05 112.51,38.05 113.35,38.89 R5.2
UUSB_N
  Top 0.305: R4.1 116.25,37.45 J2.2
UUSB_P
  Top 0.305: R5.1 116.14,38.1 J2.3
V_BATT
  Top 0.203: 29.82,42.67 JP9.2 | 34.61,43.18 C32.1
  Top 0.305: R11.1 29.82,42.67 | JP9.2 30.33,43.18 34.61,43.18 | C32.1 37.68,40.11 D4.A
V_USB  (via drill 0.35)
  Top 0.305: J2.1 121.76,36.8 v121.54,36.58 | U$2.7 92.85,36.83 95.25,36.83 v101.6,36.83 | v101.6,36.83 | v123.19,30.48 116.84,30.48 115.57,30.48 114.3,29.21 114.3,27.94 114.3,26.67 113.03,25.4 106.68,25.4 105.73,24.45 R10.2
  Bottom 0.305: v101.6,36.83 121.28,36.83 v121.54,36.58
  other vias: 124.46,29.21 125.73,30.48 123.19,27.94 123.19,25.4
  pour PWR (isolate 0.305, rank 5): 128.27,44.45 128.27,21.59 120.65,21.59 120.65,44.45
  pour Top: 121.92,22.86 128.27,22.86 128.27,31.75 121.92,31.75
VC0
  Top 0.203: R13.2 12.61,2.02
  Top 0.305: 12.61,2.02 C13.2 18.53,2.02 20.32,3.81 20.32,5.08 28.7,13.46 28.7,25.27 30.11,26.68 U3.41
VC1
  Top 0.203: R14.2 12.66,3.92
  Top 0.305: 12.66,3.92 C13.1 17.72,3.92 C14.2 27.94,14.15 27.94,25.4 29.72,27.18 U3.40
VC2
  Top 0.203: C15.2 15.39,6.43 15.24,6.43 15.28,6.46 | C14.1 18.65,6.46 | U3.39
  Top 0.305: R15.2 15.24,6.43 | C14.1 15.28,6.46 | 18.65,6.46 27.18,14.99 27.18,25.53 29.34,27.69 U3.39
VC3
  Top 0.203: 15.09,8.71 C15.1
  Top 0.305: R16.2 15.09,8.71 | C15.1 17.59,8.37 C16.2 20.18,9.13 26.42,15.37 26.42,25.78 28.81,28.18 U3.38
VC4
  Top 0.203: 12.48,11.04 R17.2 | C17.2
  Top 0.305: C17.2 12.48,11.04 | C17.2 C16.1 21.06,11.03 25.65,15.63 25.65,25.91 28.43,28.68 U3.37
VC5
  Top 0.203: R18.2 12.78,12.94 | C17.1 15.69,12.69
  Top 0.305: 12.78,12.94 C17.1 | 15.69,12.69 21.57,12.69 24.89,16 24.89,26.16 27.91,29.18 U3.36
VC5B
  Top 0.203: 20.32,14.31 R20.2
  Top 0.305: 20.32,14.31 C18.1 23.04,16.69 24.13,17.78 24.13,26.29 27.52,29.68 U3.35
VC5X  (via drill 0.35)  (1 unrouted)
  Top 0.203: C19.2 15.37,16.69 15.27,16.59 | 49.46,42.67 C33.1 | 45.91,39.88 C11.1 45.67,40.11 | 43.94,40.19 D6.A | 18.42,17.15 C18.2
  Top 0.305: R19.2 15.27,16.59 | 15.37,16.69 C18.2 | 49.46,42.67 C12.1 45.91,39.88 | D6.A 45.67,40.11 | C31.2 43.94,40.19 | 18.42,17.15 19.18,17.91 21.21,17.91 22.1,18.8 | R35.1 22.1,18.8 | 22.1,18.8 v22.86,18.03
  Bottom 0.305: J6.3 22.86,17.29 v22.86,18.03 22.86,24.13 38.1,39.37 39.37,39.37 42.67,42.67 v45.97,42.67
VC6
  Top 0.203: 15.22,18.87 C19.1 | C20.2 17.93,18.87
  Top 0.305: R21.2 15.22,18.87 17.93,18.87 | C20.2 20.52,21.45 20.52,23.48 24.27,27.24 24.27,29.53 24.92,30.18 U3.34
VC7
  Top 0.203: R22.2 12.48,21.2 | C21.2 15.24,21.2 15.24,21.19
  Top 0.305: 12.48,21.2 15.24,21.2 | 15.24,21.19 C20.1 19.88,22.72 19.88,23.69 23.64,27.45 23.64,29.73 24.58,30.68 U3.33
VC8
  Top 0.203: R23.2 12.78,23.1
  Top 0.305: 12.78,23.1 C21.1 17.72,23.1 C22.2 19.04,23.74 22.98,27.68 22.98,29.96 24.19,31.18 U3.32
VC9
  Top 0.203: R24.2 12.53,25.64 | C22.1
  Top 0.305: 12.53,25.64 C23.2 C22.1 | C22.1 20.05,25.64 22.37,27.96 22.37,30.24 23.8,31.68 U3.31
VC10
  Top 0.203: 14.96,28.02 C23.1
  Top 0.305: R25.2 14.96,28.02 | C23.1 21.19,27.54 21.84,28.19 21.84,30.48 23.54,32.18 U3.30
VC10B
  Top 0.203: C24.1 20.32,29.04 R27.2
  Top 0.305: C24.1 21.58,32.68 U3.29
VC10X  (via drill 0.35)
  Top 0.203: R26.2 12.61,31.36 | 15.5,31.42 C25.2 | 42.04,40.2 D5.A
  Top 0.305: 12.61,31.36 C25.2 16.64,30.16 v16.64,29.97 | C24.2 15.5,31.42 | C32.2 C31.1 | C31.1 42.04,40.2 | v38.86,41.02 39.56,41.72 C31.1
  Bottom 0.305: v38.86,41.02 27.69,41.02 v16.64,29.97 16.64,19.51 J6.1
VC11
  Top 0.203: R28.2 12.66,33.26 | C25.1 15.24,33.26 15.75,33.77
  Top 0.305: 12.66,33.26 15.24,33.26 | 15.75,33.77 C26.2 27.12,33.77 27.71,33.18 U3.28
VC12
  Top 0.203: C27.2 15.39,35.76 15.24,35.76 15.33,35.67
  Top 0.305: R29.2 15.24,35.76 | 15.33,35.67 C26.1 26.05,35.67 28.04,33.68 U3.27
VC13
  Top 0.203: 15.09,38.05 C27.1
  Top 0.305: R30.2 15.09,38.05 | C27.1 17.72,37.7 C28.2 24.27,38.34 28.44,34.18 U3.26
VC14
  Top 0.203: 15.35,40.34 C29.2
  Top 0.305: R31.2 15.35,40.34 | C29.2 C28.1 23.26,40.24 28.82,34.68 U3.25
VC15
  Top 0.203: 14.96,42.62 C29.1 | U3.24
  Top 0.305: R32.2 14.96,42.62 | C29.1 22.24,42.15 29.21,35.18 U3.24
VCC-ISO  (via drill 0.35)  (1 unrouted)
  Top 0.203: 44.75,28.68 C35.1 | U3.8 35.79,28.68 v35.69,28.57
  Top 0.305: U5.8 51.44,31.11 50.8,30.48 v50.8,29.21 | OK2.4 v50.8,13.97
  other vias: 45.21,29.21
  pour PWR: 52.07,44.45 52.07,0 0,0 0,44.45
VIN  (via drill 0.35)
  Top 0.305: D1.A 125.73,17.67 v125.73,13.97 | LED1.C 114,12.62 J1.6
  other vias: 123.19,15.24 123.19,17.78
  pour PWR (isolate 0.305, rank 6): 128.27,0 128.27,21.59 120.65,21.59 120.65,0
  pour Top: 128.27,20.32 121.92,20.32 121.92,12.06 128.27,12.06